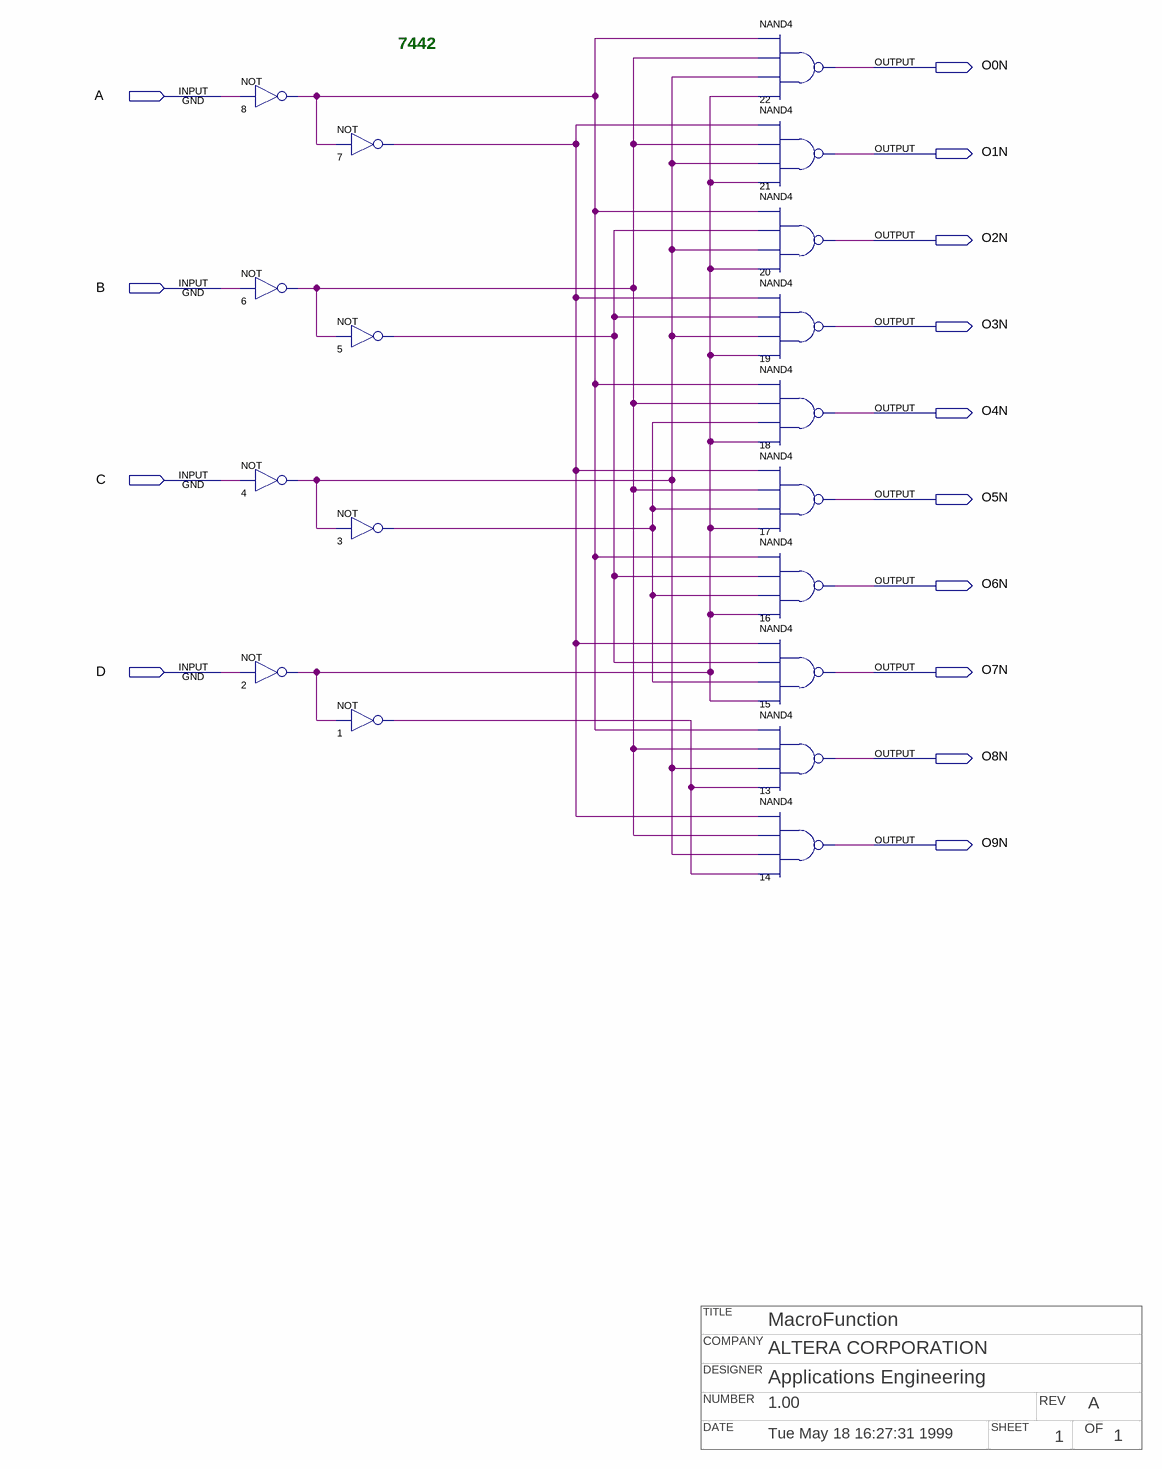
[diagram p0: schematic sheet]
// Quartus schematic 7442.bdf as structural Verilog: 18 symbols, 14 pins
// Title block: TITLE: MacroFunction; COMPANY: ALTERA CORPORATION; DESIGNER: Applications Engineering; NUMBER: 1.00; REV: A; DATE: Tue May 18 16:27:31 1999; SHEET: 1; OF: 1
module \7442  (
  input  A,
  input  B,
  input  C,
  input  D,
  output O0N,
  output O1N,
  output O2N,
  output O3N,
  output O4N,
  output O5N,
  output O6N,
  output O7N,
  output O8N,
  output O9N
);

  wire n1_out, n2_out, n3_out, n4_out, n5_out, n6_out, n7_out, n8_out;

  not u_8 (n8_out, A);
  not u_6 (n6_out, B);
  not u_4 (n4_out, C);
  not u_2 (n2_out, D);
  not u_7 (n7_out, n8_out);
  not u_5 (n5_out, n6_out);
  not u_3 (n3_out, n4_out);
  not u_1 (n1_out, n2_out);
  nand u_22 (O0N, n8_out, n6_out, n4_out, n2_out);
  nand u_21 (O1N, n7_out, n6_out, n4_out, n2_out);
  nand u_20 (O2N, n8_out, n5_out, n4_out, n2_out);
  nand u_19 (O3N, n7_out, n5_out, n4_out, n2_out);
  nand u_18 (O4N, n8_out, n6_out, n3_out, n2_out);
  nand u_17 (O5N, n7_out, n6_out, n3_out, n2_out);
  nand u_16 (O6N, n8_out, n5_out, n3_out, n2_out);
  nand u_15 (O7N, n7_out, n5_out, n3_out, n2_out);
  nand u_13 (O8N, n8_out, n6_out, n4_out, n1_out);
  nand u_14 (O9N, n7_out, n6_out, n4_out, n1_out);

  // Notes on the sheet:
  //   7442
endmodule
